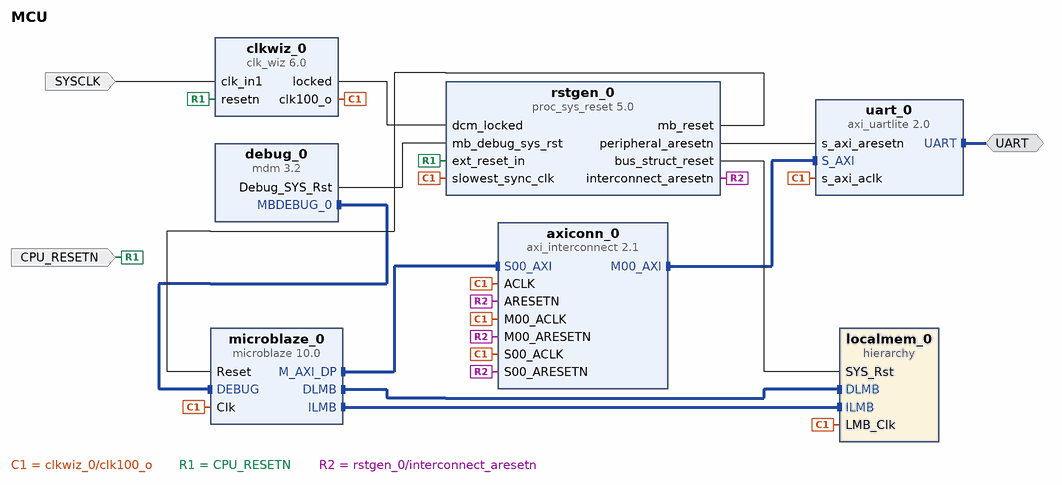
[diagram p0: block diagram of the top level]
# Vivado block design MCU, xc7a200tsbg484-1, Vivado 2018.1
create_bd_design MCU

create_bd_intf_port -mode Master -vlnv xilinx.com:interface:uart_rtl:1.0 UART
create_bd_port -dir I -type clk SYSCLK
set_property -dict {CONFIG.FREQ_HZ 100000000} [get_bd_ports SYSCLK]
create_bd_port -dir I -type rst CPU_RESETN

create_bd_cell -type ip -vlnv xilinx.com:ip:microblaze:10.0 microblaze_0
set_property -dict [list \
  CONFIG.C_AREA_OPTIMIZED 0 \
  CONFIG.C_D_AXI 1 \
  CONFIG.C_D_LMB 1 \
  CONFIG.C_I_LMB 1 \
  CONFIG.C_DEBUG_ENABLED 1 \
  CONFIG.C_ADDR_TAG_BITS 0 \
  CONFIG.C_DCACHE_ADDR_TAG 0 \
] [get_bd_cells microblaze_0]
create_bd_cell -type hier localmem_0
create_bd_cell -type ip -vlnv xilinx.com:ip:mdm:3.2 debug_0
create_bd_cell -type ip -vlnv xilinx.com:ip:clk_wiz:6.0 clkwiz_0
set_property -dict [list \
  CONFIG.ENABLE_CLOCK_MONITOR false \
  CONFIG.PRIMITIVE PLL \
  CONFIG.CLK_OUT1_PORT clk100_o \
  CONFIG.PRIM_SOURCE Single_ended_clock_capable_pin \
  CONFIG.CLKOUT1_DRIVES BUFG \
  CONFIG.CLKOUT2_DRIVES BUFG \
  CONFIG.CLKOUT3_DRIVES BUFG \
  CONFIG.CLKOUT4_DRIVES BUFG \
  CONFIG.CLKOUT5_DRIVES BUFG \
  CONFIG.CLKOUT6_DRIVES BUFG \
  CONFIG.CLKOUT7_DRIVES BUFG \
  CONFIG.RESET_PORT resetn \
  CONFIG.MMCM_DIVCLK_DIVIDE 1 \
  CONFIG.MMCM_CLKFBOUT_MULT_F 9 \
  CONFIG.MMCM_COMPENSATION ZHOLD \
  CONFIG.MMCM_CLKOUT0_DIVIDE_F 9 \
  CONFIG.RESET_TYPE ACTIVE_LOW \
  CONFIG.CLK_IN1_BOARD_INTERFACE sys_clock \
  CONFIG.RESET_BOARD_INTERFACE reset \
  CONFIG.CLKOUT1_JITTER 137.681 \
  CONFIG.CLKOUT1_PHASE_ERROR 105.461 \
] [get_bd_cells clkwiz_0]
create_bd_cell -type ip -vlnv xilinx.com:ip:proc_sys_reset:5.0 rstgen_0
create_bd_cell -type ip -vlnv xilinx.com:ip:axi_uartlite:2.0 uart_0
create_bd_cell -type ip -vlnv xilinx.com:ip:axi_interconnect:2.1 axiconn_0
set_property -dict {CONFIG.NUM_MI 1} [get_bd_cells axiconn_0]

# ---- hierarchy /localmem_0 ----
current_bd_instance /localmem_0
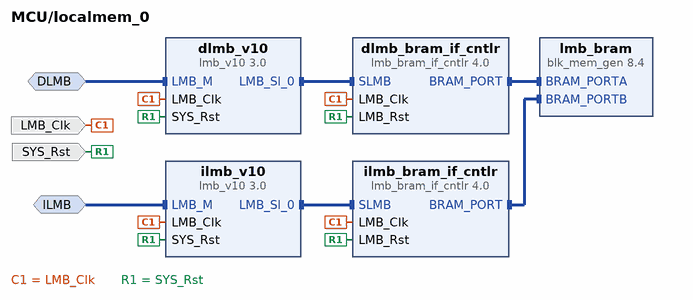
[diagram p1: block diagram inside /localmem_0]
create_bd_intf_pin -mode MirroredMaster -vlnv xilinx.com:interface:lmb_rtl:1.0 DLMB
create_bd_intf_pin -mode MirroredMaster -vlnv xilinx.com:interface:lmb_rtl:1.0 ILMB
create_bd_pin -dir I -type clk LMB_Clk
create_bd_pin -dir I -type rst SYS_Rst

create_bd_cell -type ip -vlnv xilinx.com:ip:lmb_v10:3.0 dlmb_v10
create_bd_cell -type ip -vlnv xilinx.com:ip:lmb_v10:3.0 ilmb_v10
create_bd_cell -type ip -vlnv xilinx.com:ip:lmb_bram_if_cntlr:4.0 dlmb_bram_if_cntlr
set_property -dict {CONFIG.C_ECC 0} [get_bd_cells dlmb_bram_if_cntlr]
create_bd_cell -type ip -vlnv xilinx.com:ip:lmb_bram_if_cntlr:4.0 ilmb_bram_if_cntlr
set_property -dict {CONFIG.C_ECC 0} [get_bd_cells ilmb_bram_if_cntlr]
create_bd_cell -type ip -vlnv xilinx.com:ip:blk_mem_gen:8.4 lmb_bram
set_property -dict {CONFIG.Memory_Type True_Dual_Port_RAM CONFIG.use_bram_block BRAM_Controller} [get_bd_cells lmb_bram]

# ---- connections ----

current_bd_instance /localmem_0
connect_bd_intf_net -intf_net microblaze_0_dlmb_bus [get_bd_intf_pins dlmb_v10/LMB_Sl_0] [get_bd_intf_pins dlmb_bram_if_cntlr/SLMB]
connect_bd_intf_net -intf_net microblaze_0_ilmb_bus [get_bd_intf_pins ilmb_v10/LMB_Sl_0] [get_bd_intf_pins ilmb_bram_if_cntlr/SLMB]
connect_bd_intf_net -intf_net microblaze_0_dlmb_cntlr [get_bd_intf_pins dlmb_bram_if_cntlr/BRAM_PORT] [get_bd_intf_pins lmb_bram/BRAM_PORTA]
connect_bd_intf_net -intf_net microblaze_0_ilmb_cntlr [get_bd_intf_pins ilmb_bram_if_cntlr/BRAM_PORT] [get_bd_intf_pins lmb_bram/BRAM_PORTB]
connect_bd_intf_net -intf_net microblaze_0_dlmb [get_bd_intf_pins DLMB] [get_bd_intf_pins dlmb_v10/LMB_M]
connect_bd_intf_net -intf_net microblaze_0_ilmb [get_bd_intf_pins ILMB] [get_bd_intf_pins ilmb_v10/LMB_M]
connect_bd_net -net microblaze_0_Clk [get_bd_pins LMB_Clk] \
  [get_bd_pins dlmb_v10/LMB_Clk] [get_bd_pins dlmb_bram_if_cntlr/LMB_Clk] [get_bd_pins ilmb_v10/LMB_Clk] \
  [get_bd_pins ilmb_bram_if_cntlr/LMB_Clk]
connect_bd_net [get_bd_pins SYS_Rst] \
  [get_bd_pins dlmb_v10/SYS_Rst] [get_bd_pins dlmb_bram_if_cntlr/LMB_Rst] [get_bd_pins ilmb_v10/SYS_Rst] \
  [get_bd_pins ilmb_bram_if_cntlr/LMB_Rst]

current_bd_instance /
connect_bd_intf_net [get_bd_intf_pins microblaze_0/DLMB] [get_bd_intf_pins localmem_0/DLMB]
connect_bd_intf_net [get_bd_intf_pins microblaze_0/ILMB] [get_bd_intf_pins localmem_0/ILMB]
connect_bd_intf_net [get_bd_intf_pins debug_0/MBDEBUG_0] [get_bd_intf_pins microblaze_0/DEBUG]
connect_bd_intf_net [get_bd_intf_pins microblaze_0/M_AXI_DP] [get_bd_intf_pins axiconn_0/S00_AXI]
connect_bd_intf_net -intf_net axi_interconnect_0_M00_AXI [get_bd_intf_pins axiconn_0/M00_AXI] [get_bd_intf_pins uart_0/S_AXI]
connect_bd_intf_net [get_bd_intf_ports UART] [get_bd_intf_pins uart_0/UART]
connect_bd_net -net microblaze_0_Clk [get_bd_pins clkwiz_0/clk100_o] \
  [get_bd_pins microblaze_0/Clk] [get_bd_pins localmem_0/LMB_Clk] [get_bd_pins rstgen_0/slowest_sync_clk] \
  [get_bd_pins axiconn_0/ACLK] [get_bd_pins axiconn_0/S00_ACLK] [get_bd_pins axiconn_0/M00_ACLK] \
  [get_bd_pins uart_0/s_axi_aclk]
connect_bd_net -net clk_wiz_1_locked [get_bd_pins clkwiz_0/locked] [get_bd_pins rstgen_0/dcm_locked]
connect_bd_net -net rst_clk_wiz_1_100M_mb_reset [get_bd_pins rstgen_0/mb_reset] [get_bd_pins microblaze_0/Reset]
connect_bd_net -net rst_clk_wiz_1_100M_bus_struct_reset [get_bd_pins rstgen_0/bus_struct_reset] [get_bd_pins localmem_0/SYS_Rst]
connect_bd_net -net mdm_1_debug_sys_rst [get_bd_pins debug_0/Debug_SYS_Rst] [get_bd_pins rstgen_0/mb_debug_sys_rst]
connect_bd_net [get_bd_ports SYSCLK] [get_bd_pins clkwiz_0/clk_in1]
connect_bd_net [get_bd_ports CPU_RESETN] [get_bd_pins clkwiz_0/resetn] [get_bd_pins rstgen_0/ext_reset_in]
connect_bd_net [get_bd_pins rstgen_0/interconnect_aresetn] \
  [get_bd_pins axiconn_0/ARESETN] [get_bd_pins axiconn_0/S00_ARESETN] [get_bd_pins axiconn_0/M00_ARESETN]
connect_bd_net [get_bd_pins rstgen_0/peripheral_aresetn] [get_bd_pins uart_0/s_axi_aresetn]

# ---- address map ----
assign_bd_address -offset 0x00000000 -range 32K -target_address_space [get_bd_addr_spaces microblaze_0/Data] [get_bd_addr_segs localmem_0/dlmb_bram_if_cntlr/SLMB/Mem]
assign_bd_address -offset 0x00000000 -range 32K -target_address_space [get_bd_addr_spaces microblaze_0/Instruction] [get_bd_addr_segs localmem_0/ilmb_bram_if_cntlr/SLMB/Mem]

validate_bd_design
save_bd_design
